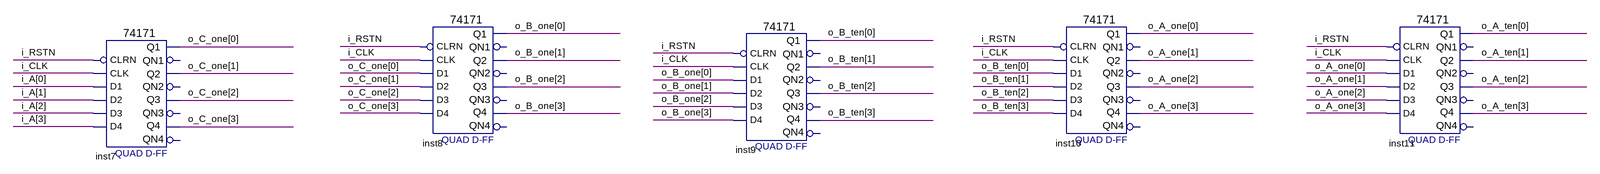
[diagram p0: schematic sheet]
// Quartus schematic shift_3_bcd_bak.bdf as structural Verilog: 5 symbols, 0 pins
module shift_3_bcd_bak (
);

  wire i_CLK, i_RSTN;
  wire [3:0] i_A, o_A_one, o_A_ten, o_B_one, o_B_ten, o_C_one;

  \74171  inst7 (
    .CLRN(i_RSTN), .D1(i_A[0]), .CLK(i_CLK), .D2(i_A[1]), .D4(i_A[3]), .D3(i_A[2]), .Q3(o_C_one[2]),
    .Q4(o_C_one[3]), .Q2(o_C_one[1]), .Q1(o_C_one[0]));  // open: QN4, QN3, QN1, QN2
  \74171  inst8 (
    .CLRN(i_RSTN), .D1(o_C_one[0]), .CLK(i_CLK), .D2(o_C_one[1]), .D4(o_C_one[3]), .D3(o_C_one[2]),
    .Q3(o_B_one[2]), .Q4(o_B_one[3]), .Q2(o_B_one[1]), .Q1(o_B_one[0]));  // open: QN4, QN3, QN1, QN2
  \74171  inst9 (
    .CLRN(i_RSTN), .D1(o_B_one[0]), .CLK(i_CLK), .D2(o_B_one[1]), .D4(o_B_one[3]), .D3(o_B_one[2]),
    .Q3(o_B_ten[2]), .Q4(o_B_ten[3]), .Q2(o_B_ten[1]), .Q1(o_B_ten[0]));  // open: QN4, QN3, QN1, QN2
  \74171  inst10 (
    .CLRN(i_RSTN), .D1(o_B_ten[0]), .CLK(i_CLK), .D2(o_B_ten[1]), .D4(o_B_ten[3]), .D3(o_B_ten[2]),
    .Q3(o_A_one[2]), .Q4(o_A_one[3]), .Q2(o_A_one[1]), .Q1(o_A_one[0]));  // open: QN4, QN3, QN1, QN2
  \74171  inst11 (
    .CLRN(i_RSTN), .D1(o_A_one[0]), .CLK(i_CLK), .D2(o_A_one[1]), .D4(o_A_one[3]), .D3(o_A_one[2]),
    .Q3(o_A_ten[2]), .Q4(o_A_ten[3]), .Q2(o_A_ten[1]), .Q1(o_A_ten[0]));  // open: QN4, QN3, QN1, QN2
endmodule
